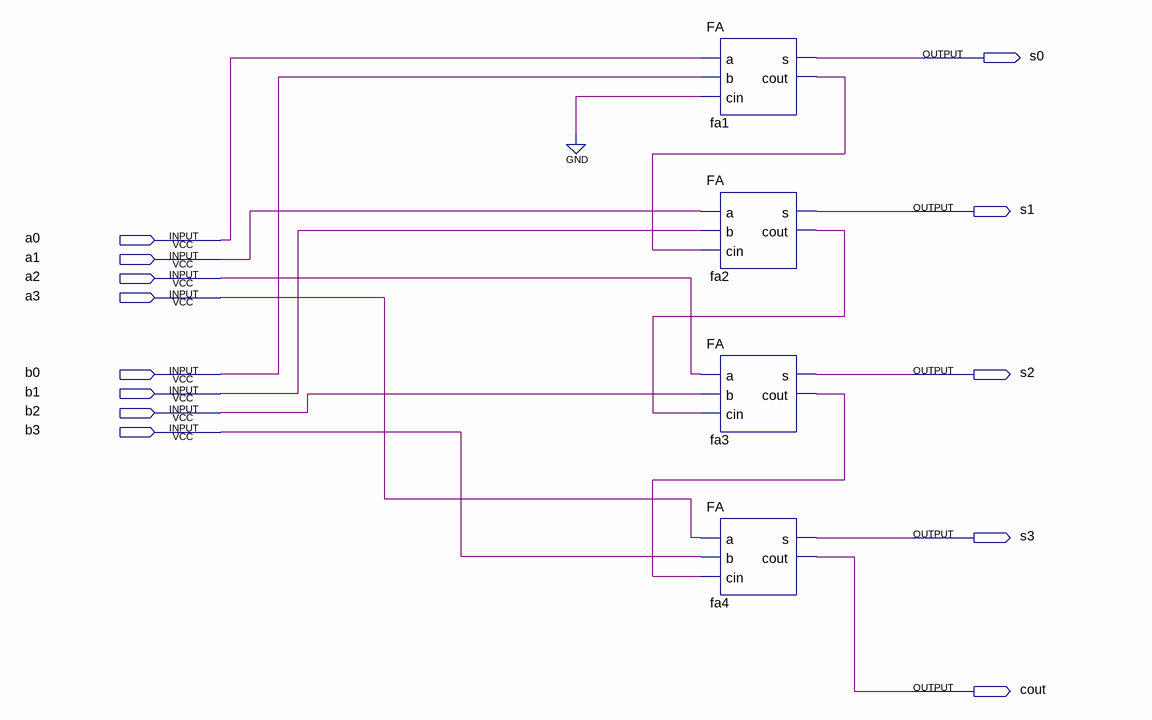
[diagram p0: schematic sheet]
// Quartus schematic 4bitadder.bdf as structural Verilog: 4 symbols, 13 pins
module \4bitadder  (
  input  a0,
  input  a1,
  input  a2,
  input  a3,
  input  b0,
  input  b1,
  input  b2,
  input  b3,
  output s0,
  output s1,
  output s2,
  output s3,
  output cout
);

  wire fa1_cout, fa2_cout, fa3_cout;

  FA fa1 (.a(a0), .b(b0), .cin(1'b0), .s(s0), .cout(fa1_cout));
  FA fa2 (.a(a1), .b(b1), .cin(fa1_cout), .s(s1), .cout(fa2_cout));
  FA fa3 (.a(a2), .b(b2), .cin(fa2_cout), .s(s2), .cout(fa3_cout));
  FA fa4 (.a(a3), .b(b3), .cin(fa3_cout), .s(s3), .cout(cout));
endmodule
